# EAGLE design SNES_RGBAmp_wCSYNC_SVid (EAGLE 7.7.0)
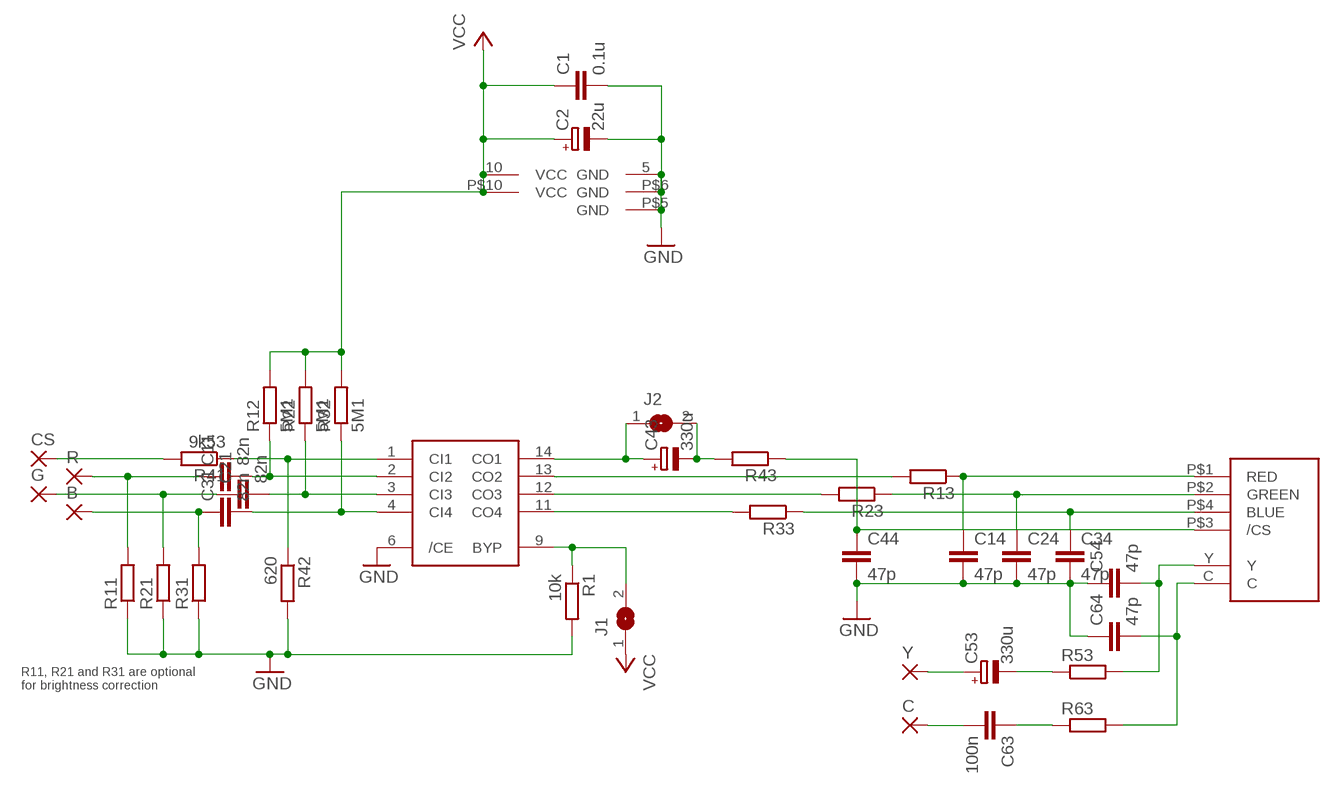
[diagram p0: schematic, sheet 1]

## Parts
B  SMD2  [SMD1,27-2,54]
C  SMD2  [SMD1,27-2,54]
C1  0.1u  C-EUC0603K  [C0603K]
C2  22u  CPOL-EUSMCB  [SMC_B]
C11  82n  C-EUC0603K  [C0603K]
C14  47p  C-EUC0603K  [C0603K]
C21  82n  C-EUC0603K  [C0603K]
C24  47p  C-EUC0603K  [C0603K]
C31  82n  C-EUC0603K  [C0603K]
C34  47p  C-EUC0603K  [C0603K]
C43  330u  CPOL-EUSMCD  [SMC_D]
C44  47p  C-EUC0603K  [C0603K]
C53  330u  CPOL-EUSMCD  [SMC_D]
C54  47p  C-EUC0603K  [C0603K]
C63  100n  C-EUC0603K  [C0603K]
C64  47p  C-EUC0603K  [C0603K]
CS  SMD2  [SMD1,27-2,54]
G  SMD2  [SMD1,27-2,54]
J1  SJ  [SJ]
J2  SJ  [SJ]
R  SMD2  [SMD1,27-2,54]
R1  10k  R-EU_R0603  [R0603]
R11  R-EU_R0603  [R0603]
R12  5M1  R-EU_R0603  [R0603]
R13  R-EU_R0603  [R0603]
R21  R-EU_R0603  [R0603]
R22  5M1  R-EU_R0603  [R0603]
R23  R-EU_R0603  [R0603]
R31  R-EU_R0603  [R0603]
R32  5M1  R-EU_R0603  [R0603]
R33  R-EU_R0603  [R0603]
R41  9k53  R-EU_R0603  [R0603]
R42  620  R-EU_R0603  [R0603]
R43  R-EU_R0603  [R0603]
R53  R-EU_R0603  [R0603]
R63  R-EU_R0603  [R0603]
U1  THS7374  [THS7374]
U$1  SNES_MULTIAV_RGBSYC  [SNES_MULTIAV_RGBSYC]
Y  SMD2  [SMD1,27-2,54]

## Nets
GND: C1.2 C2.- C14.2 C24.2 C34.2 C44.2 C54.1 C64.1 R1.2 R11.1 R21.1 R31.1 R42.2 U1.5(GND) U1.6(/CE) U$1.P$5(GND) U$1.P$6(GND)
N$1: C11.2 R12.1 U1.2(CI2)
N$2: C21.2 R22.1 U1.3(CI3)
N$3: J1.2 R1.1 U1.9(BYP)
N$4: C44.1 R43.1 U$1.P$3(/CS)
N$5: C14.1 R13.1 U$1.P$1(RED)
N$6: C24.1 R23.1 U$1.P$2(GREEN)
N$7: R23.2 U1.12(CO3)
N$8: R13.2 U1.13(CO2)
N$9: C34.1 R33.1 U$1.P$4(BLUE)
N$10: R41.1 R42.1 U1.1(CI1)
N$11: R33.2 U1.11(CO4)
N$12: C53.+ Y.1(P)
N$13: C63.2 C.1(P)
N$14: C11.1 R11.2 R.1(P)
N$15: C21.1 G.1(P) R21.2
N$16: B.1(P) C31.1 R31.2
N$17: CS.1(P) R41.2
N$18: C43.+ J2.1 U1.14(CO1)
N$19: C43.- J2.2 R43.2
N$20: C53.- R53.1
N$21: C54.2 R53.2 U$1.Y
N$22: C64.2 R63.2 U$1.C
N$23: C63.1 R63.1
R9: C31.2 R32.1 U1.4(CI4)
VCC: C1.1 C2.+ J1.1 R12.2 R22.2 R32.2 U1.10(VCC) U$1.P$10(VCC)

## Notes on the sheet
- R11, R21 and R31 are optional
  for brightness correction

## Library data of the parts
B C CS G R Y = wirepad:SMD2: SMD PAD
C1 C11 C14 C21 C24 C31 C34 C44 C54 C63 C64 = rcl:C-EU: CAPACITOR, European symbol
C2 C43 C53 = rcl:CPOL-EU: POLARIZED CAPACITOR, European symbol
J1 J2 = jumper:SJ: SMD solder JUMPER
R1 R11-R13 R21-R23 R31-R33 R41-R43 R53 R63 = rcl:R-EU_: RESISTOR, European symbol
U1 = snes_div:THS7374
U$1 = snes_div:SNES_MULTIAV_RGBSYC

## Board
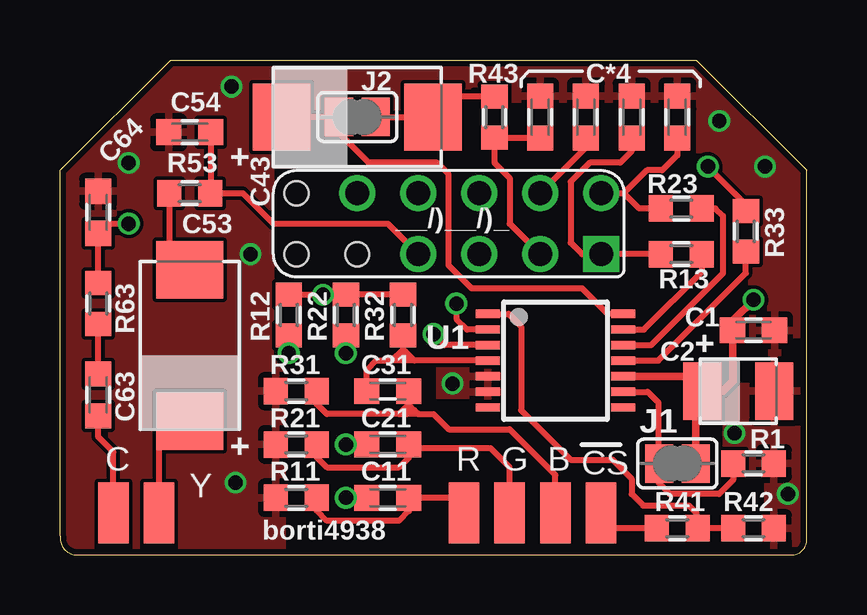
[diagram p1: board, top side]
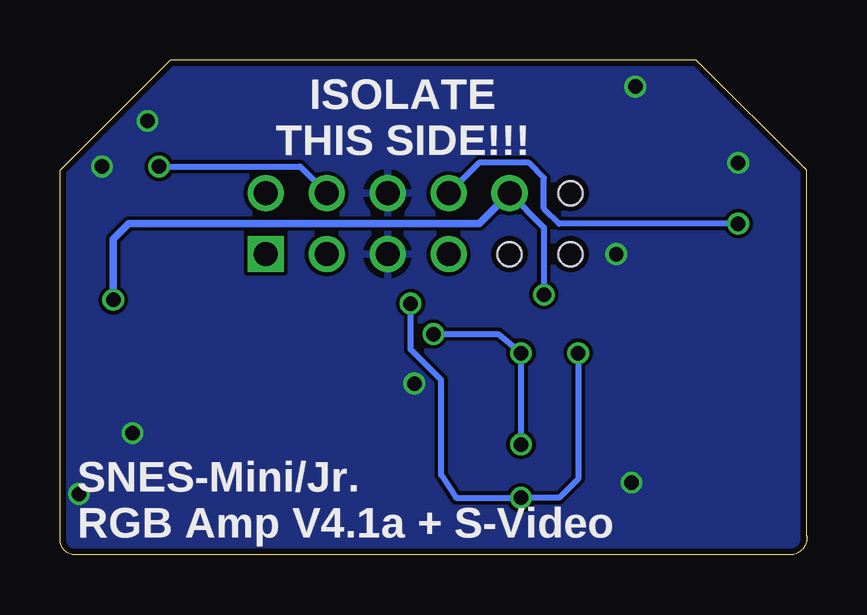
[diagram p2: board, bottom side, seen from below]

Size 31.12 x 20.64 mm. Coordinates in mm from the lower left corner, seen from the top.
Outline: 0,0.79 arc90 0.64,0 30.48,0 arc90 31.12,0.64 31.12,16.03 26.52,20.64 4.61,20.64 0,16.03 0,0.79
Copper layers (1*16): Top 0.035mm / dielectric 1.5mm / Bottom 0.035mm
Design rules "ITEADstudio_DRC": minimum track width 6mil, minimum drill 12mil, track to track 6mil, track to pad 6mil, pad to pad 6mil, via to via 6mil, smd to smd 0mil, copper to edge 10mil, drill to drill 10mil, minimum pad ring 10mil, minimum via ring 6mil, stop-mask expansion 2mil, vias tented up to drill 30mil, thermal gap 10mil
tRestrict: area 16.4,11.3 to 19.4,18.7; area 19.4,16.8 to 26.4,18.7; area 28.1,12.9 to 29.1,14; area 28.1,7.3 to 29.4,8.9; area 9.5,0.2 to 15.6,8.1; area 9.1,8.7 to 13.8,11.3; area 26.8,0.5 to 29.2,3.2; area 18.6,4.9 to 19.5,9.7; area 30.2,7.9 to 31.1,8.9; area 26.5,4.1 to 27.5,5.6; area 17.2,19 to 18.7,19.4; area 24,6 to 24.9,7; 2 more areas

### Footprints (pad centres in the part's own frame; a part is rotated, then mirrored left to right if it is on the bottom)
SMD1,27-2,54 = smd 1.27 x 2.54: 1 0,0
C0603K = smd 1.05 x 1.08: 1 -0.875,0; 2 0.875,0
SMC_B = smd 1.6 x 2.4: + -1.5,0; - 1.5,0
SMC_D = smd 2.4 x 2.8: + -3.15,0; - 3.15,0
SJ = smd 1.168 x 1.6: 1 -0.762,0; 2 0.762,0
R0603 = smd 1 x 1.1: 1 -0.85,0; 2 0.85,0
THS7374 = smd 0.35 x 1: 1 -1.95,-2.825; 2 -1.3,-2.825; 3 -0.65,-2.825; 4 0,-2.825; 5 0.65,-2.825; 6 1.3,-2.825; 7 1.95,-2.825; 8 1.95,2.825; 9 1.3,2.825; 10 0.65,2.825; 11 0,2.825; 12 -0.65,2.825; 13 -1.3,2.825; 14 -1.95,2.825
SNES_MULTIAV_RGBSYC = drill 1: C -1.27,1.27; P$2 6.35,1.27; P$3 3.81,-1.27; P$4 3.81,1.27; P$5 1.27,-1.27; P$6 1.27,1.27; P$10 -3.81,1.27; Y -1.27,-1.27 | drill 1 square: P$1 6.35,-1.27 | hole 1: -3.81,-1.27; -6.35,-1.27; -6.35,1.27

### Placement (x,y rotation side)
B  20.64,1.75 0 top
C  2.23,1.75 180 top
C1  28.9,9.37 0 top
C2  28.26,6.83 0 top
C11  13.66,2.38 180 top
C14  23.82,18.26 90 top
C21  13.66,4.6 180 top
C24  25.72,18.26 90 top
C31  13.66,6.83 180 top
C34  21.91,18.26 90 top
C43  12.39,18.26 0 top
C44  20.01,18.26 90 top
C53  5.4,8.73 90 top
C54  5.4,17.62 0 top
C63  1.59,6.67 270 top
C64  1.59,14.29 270 top
CS  22.55,1.75 0 top
G  18.74,1.75 0 top
J1  25.72,3.81 180 top
J2  12.39,18.26 0 top
R  16.83,1.75 0 top
R1  28.9,3.81 0 top
R11  9.85,2.38 0 top
R12  9.53,10 90 top
R13  25.88,12.54 0 top
R21  9.85,4.6 0 top
R22  11.91,10 90 top
R23  25.88,14.45 0 top
R31  9.85,6.83 0 top
R32  14.29,10 90 top
R33  28.58,13.49 270 top
R41  25.72,1.11 180 top
R42  28.9,1.11 0 top
R43  18.1,18.26 90 top
R53  5.4,15.08 0 top
R63  1.59,10.48 90 top
U1  20.64,8.1 270 top
U$1  16.2,13.81 0 top
Y  4.13,1.75 180 top

### Tracks (layer width: path | path; a pad name or v marks a point on that pad's centre or on a via)
GND  (via drill 0.6)
  Top 0.254: 4.61,17.54 C54.1
  other vias: 16.36,7.14 30.33,2.54 27.47,18.1 7.94,12.54 29.37,16.19 28.1,5.08 2.86,16.35 7.31,3.02 7.15,19.53
  pour Bottom: -0.95,-0.16 32.07,-0.16 32.07,21.43 -0.95,21.43
  pour Top: -0.95,-0.16 32.07,-0.16 32.07,21.43 -0.95,21.43
N$1  (via drill 0.6)
  Top 0.254: R12.1 v9.53,8.41 | C11.2 v11.91,2.38 | U1.2 16.96,9.4 16.51,9.84 v16.51,10.48
  Bottom 0.254: v9.53,8.41 9.53,3.18 10.32,2.38 v11.91,2.38 14.61,2.38 15.24,3.33 15.24,7.3 16.51,8.57 v16.51,10.48
N$2  (via drill 0.6)
  Top 0.254: C21.2 v11.91,4.6 | v11.91,8.41 R22.1 | U1.3 16.02,8.75 v15.56,9.21
  Bottom 0.254: v11.91,4.6 v11.91,8.41 12.86,9.21 v15.56,9.21
N$3
  Top 0.254: R1.1 28.05,3.12 27.47,2.54 25.4,2.54 24.93,3.02 24.93,3.62 J1.2 24.93,3.68 24.93,6.35 24.48,6.8 U1.9
N$4
  Top 0.254: C44.1 18.13,17.38 R43.1 18.1,16.35 18.74,15.72 18.74,13.81 U$1.P$3
N$5
  Top 0.254: C14.1 23.82,16.83 23.34,16.35 22.07,16.35 21.28,15.56 21.28,13.02 21.75,12.54 U$1.P$1 R13.1
N$6
  Top 0.254: C24.1 25.72,16.67 25.09,16.03 24.45,16.03 23.5,15.08 | R23.1 24.13,14.45 23.5,15.08 | U$1.P$2 23.5,15.08
N$7
  Top 0.254: U1.12 24.63,8.75 27.63,11.75 27.63,14.13 27.31,14.45 R23.2
N$8
  Top 0.254: U1.13 24.32,9.4 26.73,11.8 R13.2
N$9  (via drill 0.6)
  Top 0.254: C34.1 21.91,16.99 U$1.P$4 | v26.99,16.19 28.58,14.61 R33.1
  Bottom 0.254: v26.99,16.19 21.12,16.19 U$1.P$4
N$10
  Top 0.254: R42.1 R41.1 26.52,1.17 26.52,1.75 26.2,2.06 24.29,2.06 23.82,2.54 23.82,3.18 23.02,3.97 21.28,3.97 19.21,6.03 19.21,9.53 18.69,10.05 U1.1
N$11
  Top 0.254: U1.11 24.93,8.1 28.58,11.75 R33.2
N$12
  Top 0.254: Y.1 4.13,5.4 4.29,5.56 5.38,5.56 C53.+
N$13
  Top 0.254: C.1 2.23,4.29 1.59,4.92 C63.2
N$14
  Top 0.254: R11.2 10.7,1.85 11.12,1.43 14.13,1.43 14.53,1.83 C11.1 | C11.1 14.53,2.62 14.13,2.22 | R.1 16.83,2.38 C11.1
N$15
  Top 0.254: R21.2 10.7,4.07 11.12,3.65 14.13,3.65 14.53,4.05 C21.1 14.69,4.45 17.94,4.45 18.74,3.65 G.1
N$16
  Top 0.254: R31.2 10.7,6.29 11.12,5.87 14.13,5.87 | C31.1 14.53,6.27 | 14.53,6.27 14.13,5.87 | B.1 20.64,3.33 18.74,5.24 16.2,5.24 15.56,5.87 14.93,5.87 | 14.53,6.27 14.77,6.03 | 14.93,5.87 14.45,5.87 | 14.13,5.87 14.45,5.87 | 14.45,5.87 14.61,6.03 14.77,6.03 | 14.77,6.03 14.93,5.87
N$17
  Top 0.254: R41.2 22.55,1.11 CS.1
N$18
  Top 0.254: C43.+ J2.1 11.59,18.22 11.75,17.46 12.86,16.35 15.72,16.35 16.2,15.88 16.2,12.07 17.15,11.11 21.75,11.11 22.82,10.05 U1.14
N$19
  Top 0.254: R43.2 16.39,19.11 C43.- J2.2
N$20
  Top 0.254: R53.1 4.55,12.73 C53.-
N$21
  Top 0.254: C54.2 6.28,15.11 R53.2 7.62,15.08 8.89,13.81 13.66,13.81 U$1.Y
N$22  (via drill 0.6)
  Top 0.254: R63.2 C64.2 1.59,13.81 v2.86,13.81
  Bottom 0.254: v2.86,13.81 10.32,13.81 10.96,14.45 10.96,15.72 11.59,16.35 13.66,16.35 U$1.C
N$23
  Top 0.254: C63.1 R63.1
R9
  Top 0.254: 13.02,7.23 C31.2 12.78,7.7 13.18,8.1 13.82,8.1 | 14.29,8.1 13.82,8.1 | 13.82,8.1 14.29,8.57 14.77,8.1 | 14.77,8.1 14.29,8.1 | 14.29,8.1 14.45,8.26 14.29,8.26 | 14.13,8.26 14.29,8.26 | 14.29,8.26 R32.1 | U1.4 14.77,8.1
VCC  (via drill 0.6)
  Top 0.254: R12.2 v10.96,10.85 R22.2 | R32.2 R22.2 | 11.59,11.17 R22.2
  Top 0.305: v28.9,10.64 28.1,9.84 28.1,9.45 C1.1 28.02,7.22 27.63,6.83 C2.+ | U1.10 26.14,7.45 C2.+ | J1.1 26.48,6.55 C2.+
  Bottom 0.254: v10.96,10.85 10.96,13.65 U$1.P$10
  Bottom 0.305: v28.9,10.64 28.9,13.18 28.26,13.81 13.66,13.81 U$1.P$10

### Text on the board
tPlace: J2 | __/)__/)_ | U1 | J1 | borti4938
tNames: R43 | C*4 | C54 | C64 | R53 | + | C43 | R23 | C53 | R33 | R13 | C1 | R63 | R12 | R22 | R32 | R31 | C31 | C2 | + | C63 | R21 | C21 | R1 | + | R11 | C11 | R41 | R42
bNames: ISOLATE / THIS SIDE!!! | SNES-Mini/Jr. / RGB Amp V4.1a + S-Video